# EAGLE design PCB_v1 (EAGLE 8.6.2)
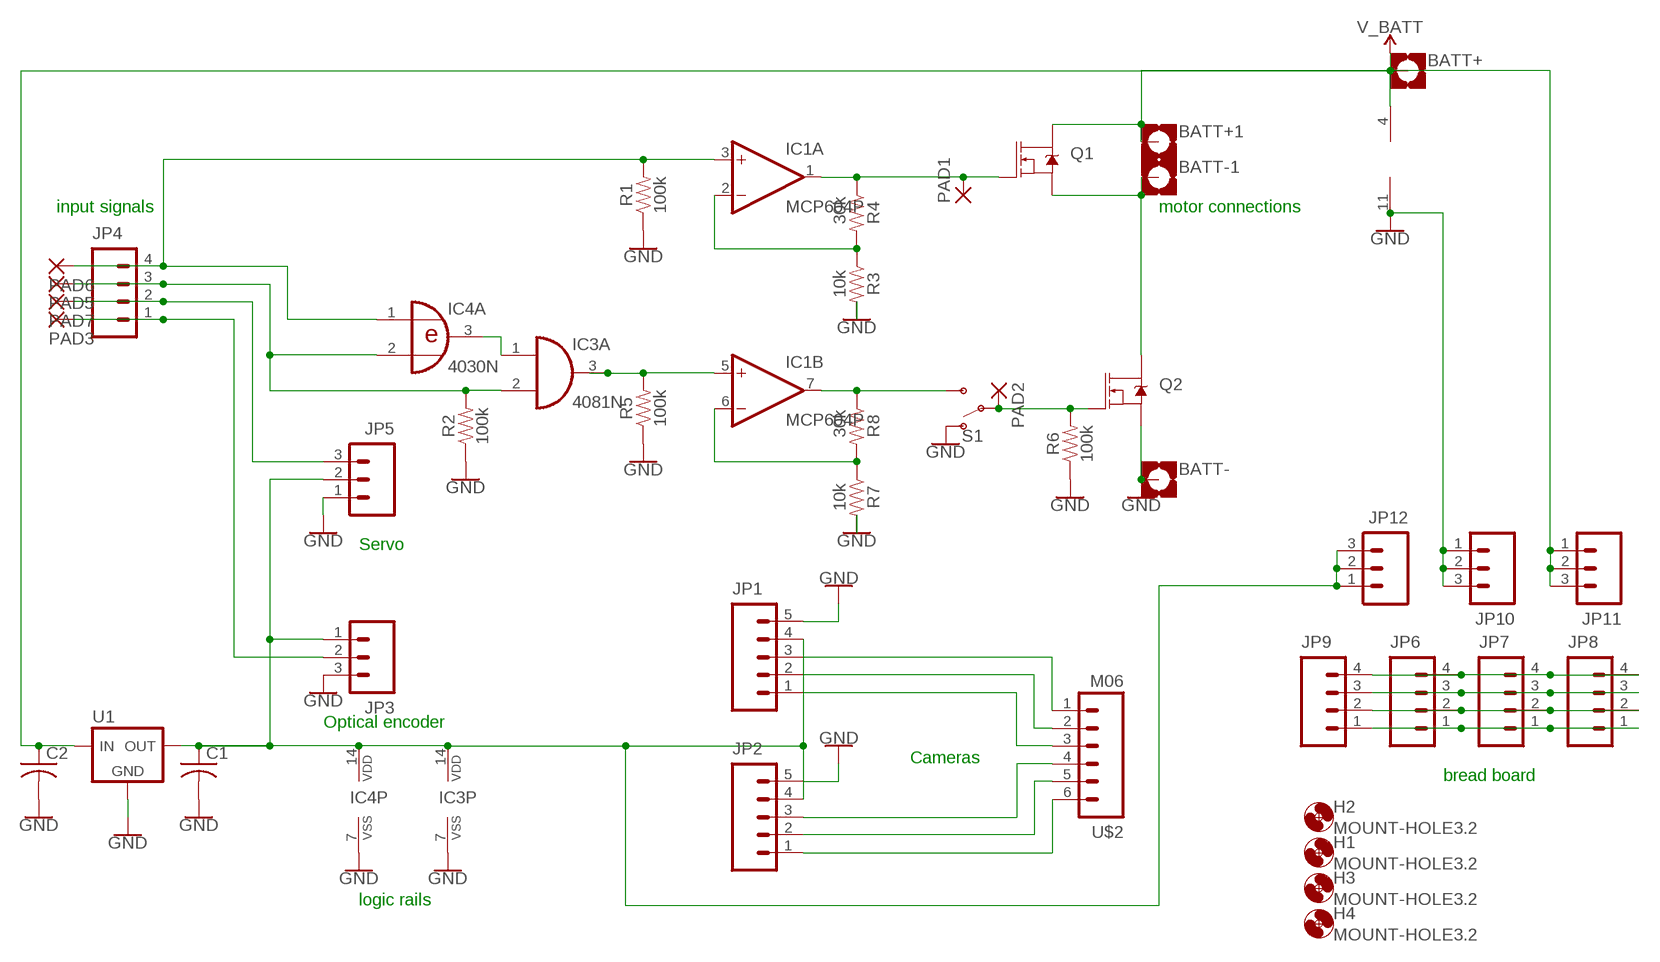
[diagram p0: schematic, sheet 1]

## Parts
BATT+  MOUNT-PAD-SQUARE3.0  [3,0-PAD-SQUARE]
BATT+1  MOUNT-PAD-SQUARE3.0  [3,0-PAD-SQUARE]
BATT-  MOUNT-PAD-SQUARE3.0  [3,0-PAD-SQUARE]
BATT-1  MOUNT-PAD-SQUARE3.0  [3,0-PAD-SQUARE]
C1  C-075PTH  [C075]
C2  C-075PTH  [C075]
H1  MOUNT-HOLE3.2  [3,2]
H2  MOUNT-HOLE3.2  [3,2]
H3  MOUNT-HOLE3.2  [3,2]
H4  MOUNT-HOLE3.2  [3,2]
IC1  MCP604P  [DIL14]
IC3  4081N  [DIL14]
IC4  4030N  [DIL14]
JP1  M05PTH  [1X05]
JP2  M05PTH  [1X05]
JP3  M03PTH  [1X03]
JP4  M04PTH  [1X04]
JP5  M03PTH  [1X03]
JP6  M04PTH  [1X04]
JP7  M04PTH  [1X04]
JP8  M04PTH  [1X04]
JP9  M04PTH  [1X04]
JP10  M03PTH  [1X03]
JP11  M03PTH  [1X03]
JP12  M03PTH  [1X03]
PAD1  2,15/1,0  [2,15/1,0]
PAD2  2,15/1,0  [2,15/1,0]
PAD3  2,15/1,0  [2,15/1,0]
PAD5  2,15/1,0  [2,15/1,0]
PAD6  2,15/1,0  [2,15/1,0]
PAD7  2,15/1,0  [2,15/1,0]
Q1  MOSFET-NCH-FQP30N06L  [TO220V]
Q2  MOSFET-NCH-FQP30N06L  [TO220V]
R1  100k  10KOHM-HORIZ-1/4W-1%  [AXIAL-0.3]
R2  100k  10KOHM-HORIZ-1/4W-1%  [AXIAL-0.3]
R3  10k  10KOHM-HORIZ-1/4W-1%  [AXIAL-0.3]
R4  30k  RESISTORAXIAL-0.3  [AXIAL-0.3]
R5  100k  10KOHM-HORIZ-1/4W-1%  [AXIAL-0.3]
R6  100k  10KOHM-HORIZ-1/4W-1%  [AXIAL-0.3]
R7  10k  10KOHM-HORIZ-1/4W-1%  [AXIAL-0.3]
R8  30k  RESISTORAXIAL-0.3  [AXIAL-0.3]
S1  SWITCH-SPDT-PTH-11.6X4.0MM-KIT  [SWITCH_SPDT_PTH_11.6X4.0MM_KIT]
U1  78XX-TO220V  [TO220BV]
U$2  M06  [1X06-MTA]

## Nets
GND: BATT-.B3,0(MOUNT) C1.2(-) C2.2(-) IC1.11(P:V-) IC3.7(P:VSS) IC4.7(P:VSS) JP1.5 JP2.5 JP3.3 JP5.1 JP10.1 JP10.2 JP10.3 Q2.3(S) R1.P$1 R2.P$1 R3.P$2 R5.P$1 R6.P$1 R7.P$2 S1.1(O) U1.2(GND)
N$1: IC1.2(A:-IN) R3.P$1 R4.P$2
N$2: IC1.1(A:OUT) PAD1.1(P) Q1.1(G) R4.P$1
N$3: IC1.6(B:-IN) R7.P$1 R8.P$2
N$5: PAD2.1(P) Q2.1(G) R6.P$2 S1.2(P)
N$6: BATT-1.B3,0(MOUNT) Q1.3(S) Q2.2(D)
N$7: IC1.7(B:OUT) R8.P$1 S1.3(S)
N$8: IC3.1(A:I0) IC4.3(A:O)
N$9: JP2.1 U$2.6
N$10: JP2.2 U$2.5
N$11: JP2.3 U$2.4
N$12: JP1.1 U$2.3
N$13: JP1.2 U$2.2
N$14: JP1.3 U$2.1
N$15: JP4.2 JP5.3 PAD7.1(P)
N$16: IC1.3(A:+IN) IC4.1(A:I0) JP4.4 PAD6.1(P) R1.P$2
N$17: IC3.2(A:I1) IC4.2(A:I1) JP4.3 PAD5.1(P) R2.P$2
N$18: C1.1(+) IC3.14(P:VDD) IC4.14(P:VDD) JP1.4 JP2.4 JP3.1 JP5.2 JP12.1 JP12.2 JP12.3 U1.3(VOUT)
N$19: JP3.2 JP4.1 PAD3.1(P)
N$20: IC1.5(B:+IN) IC3.3(A:O) R5.P$2
N$22: JP6.4 JP7.4 JP8.4 JP9.4
N$23: JP6.3 JP7.3 JP8.3 JP9.3
N$24: JP6.2 JP7.2 JP8.2 JP9.2
N$25: JP6.1 JP7.1 JP8.1 JP9.1
V_BATT: BATT+1.B3,0(MOUNT) BATT+.B3,0(MOUNT) C2.1(+) IC1.4(P:V+) JP11.1 JP11.2 JP11.3 Q1.2(D) U1.1(VIN)
Unconnected: IC1.8(C:OUT) IC1.9(C:-IN) IC1.10(C:+IN) IC1.12(D:+IN) IC1.13(D:-IN) IC1.14(D:OUT) IC3.4(B:O) IC3.5(B:I0) IC3.6(B:I1) IC3.8(C:I0) IC3.9(C:I1) IC3.10(C:O) IC3.11(D:O) IC3.12(D:I0) IC3.13(D:I1) IC4.4(B:O) IC4.5(B:I0) IC4.6(B:I1) IC4.8(C:I0) IC4.9(C:I1) IC4.10(C:O) IC4.11(D:O) IC4.12(D:I0) IC4.13(D:I1)

## Notes on the sheet
- input signals | motor connections
- Servo
- Optical encoder
- Cameras
- bread board
- logic rails

## Library data of the parts
BATT+ BATT+1 BATT- BATT-1 = holes:MOUNT-PAD-SQUARE: MOUNTING PAD, square
C1 C2 = bt_rcl:C: Capacitor, non-polarized, American symbol
H1-H4 = holes:MOUNT-HOLE: MOUNTING HOLE with drill center marker
IC1 = linear:MCP604: Quad Op Amp 2.7V to 6.0V Single Supply CMOS Source: http://ww1.microchip.com/downloads/en/DeviceDoc/21314g.pdf
IC3 = 40xx:4081: Quad 2-input AND
IC4 = 40xx:4030: Quad XOR
JP1 JP2 = ee192:M05: 5-pin 0.1-inch header and MTA connector Courtsey of Pioneers in Engineering; PIE-INT-REF-NUM: BULK-STOCK
JP3 JP5 JP10-JP12 = ee192:M03: 3-pin 0.1-inch header and MTA connector Courtsey of Pioneers in Engineering; PIE-INT-REF-NUM: BULK-STOCK
JP4 JP6-JP9 = ee192:M04: 4-pin 0.1-inch header and MTA connector Courtsey of Pioneers in Engineering; PIE-INT-REF-NUM: BULK-STOCK
PAD1-PAD3 PAD5-PAD7 = wirepad:2,15/1,0: THROUGH-HOLE PAD
Q1 Q2 = SparkFun-DiscreteSemi:MOSFET-NCH: N-channel MOSFETs Voltage controlled devices that allow control of high current outputs. SparkFun Products: SparkFun OpenScale <https://www.sparkfun.com/products/13261> SparkFun Digital Sandbox <https://www.sparkfun.com/products/12651> SparkFun Monster Moto Shield <https://www.sparkfun.com/products/10182> SparkFun MOSFET Power Controller <https://www.sparkfun.com/products/11214>; PROD_ID: TRANS-10060; VALUE: 60V/32A/35mΩ
R1 R2 R5 R6 = SparkFun-Resistors:10KOHM: 10kΩ resistor A resistor is a passive two-terminal electrical component that implements electrical resistance as a circuit element. Resistors act to reduce current flow, and, at the same time, act to lower voltage levels within circuits. - Wikipedia; PROD_ID: RES-12183; VALUE: 10k
R3 R7 = SparkFun-Resistors:10KOHM: 10kΩ resistor A resistor is a passive two-terminal electrical component that implements electrical resistance as a circuit element. Resistors act to reduce current flow, and, at the same time, act to lower voltage levels within circuits. - Wikipedia; PROD_ID: RES-12183
R4 R8 = SparkFun-Resistors:RESISTOR: Generic Resistor Package
S1 = SparkFun-Switches:SWITCH-SPDT: Single Pole, Double Throw (SPDT) Switch Single-pole, double-throw (SPDT) switch. Variant Overview SMD-AYZ0202 Surface Mount DPDT Switch <https://www.sparkfun.com/products/597> (COM-00597) Used on e.g. LilyPad Arduino USB - ATmega32U4 Board <https://www.sparkfun.com/products/12049> PTH-11.6X4.0MM SPDT Mini Power Switch <https://www.sparkfun.com/products/102> (COM-00102) Used on e.g. SparkFun Simon Says - Through-Hole Soldering Kit <https://www.sparkfun.com/products/10547> (KIT-10547) PTH-11.6X4.0MM-KIT KIT version of SPDT Mini Power Switch - Simplifies soldering by removing tStop of switch pins - only one side can be soldered. PTH-11.6X4.0MM-LOCK LOCK version of SPDT Mini Power Switch - Offset pins hold switch in place for easier soldering. SMD-RIGHT-ANGLE Surface Mount Right Angle Switch <https://www.sparkfun.com/products/10860> (COM-10860) Used on e.g. SparkFun ESP8266 Thing <https://www.sparkfun.com/products/13231>; PROD_ID: SWCH-08261; SF_SKU: COM-00102
U1 = bt_regulator:78XX: 78XX Linear Voltage Regulator The venerable 7800-series Linear Voltage Regulator, including 7805, 7809, 7812, 7815, 7862 in 5 V, 6.2 V, 8.2 V, 9 V, 12 V, and 15 V, respectively Datasheets TI_LM78L05.pdf <http://www.ti.com/lit/ds/symlink/lm78l05.pdf> Fairchild_LM7805.pdf <https://www.fairchildsemi.com/datasheets/LM/LM7805.pdf>
U$2 = ee192:M06: 6-pin 0.1-inch MTA connector Courtsey of Pioneers in Engineering; PIE-INT-REF-NUM: MTA

## Board
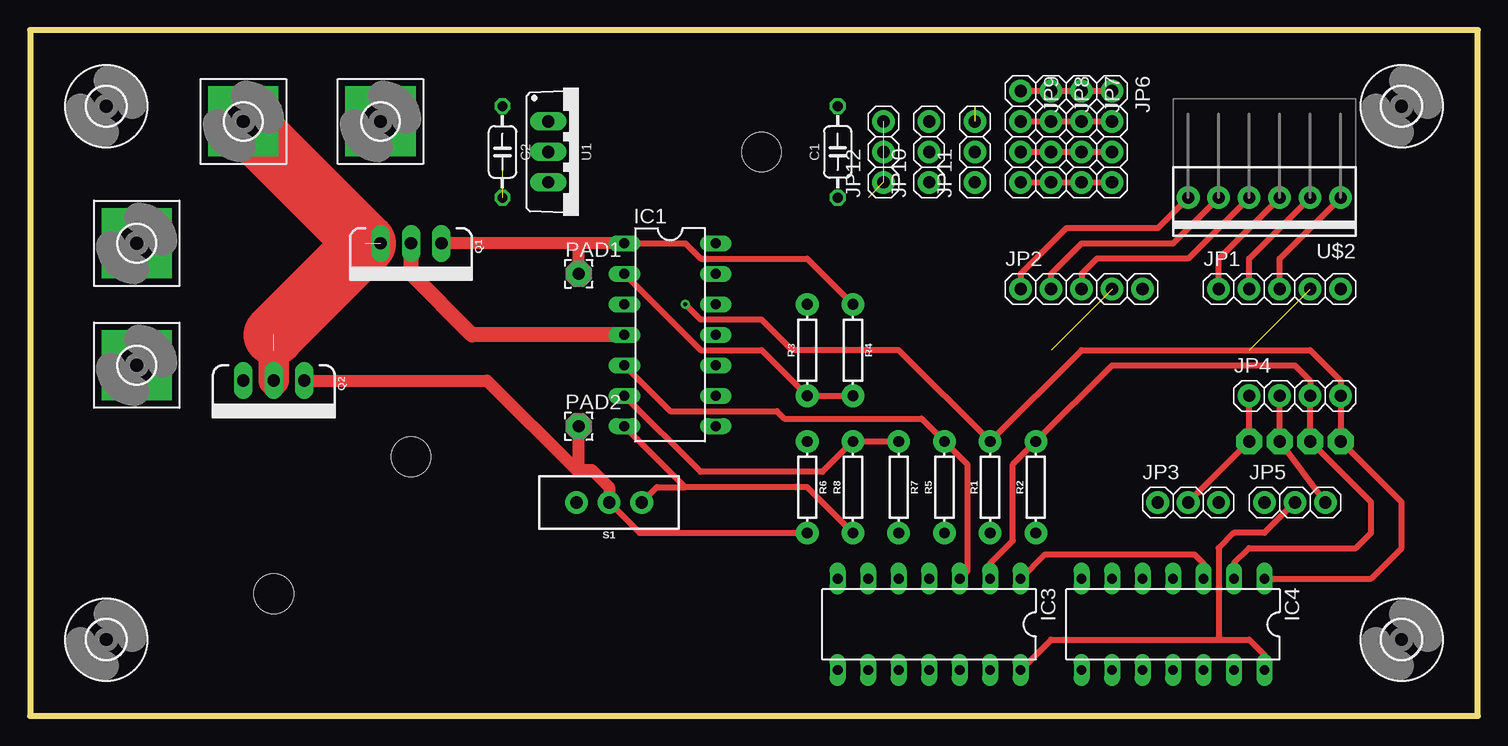
[diagram p1: board, top side]
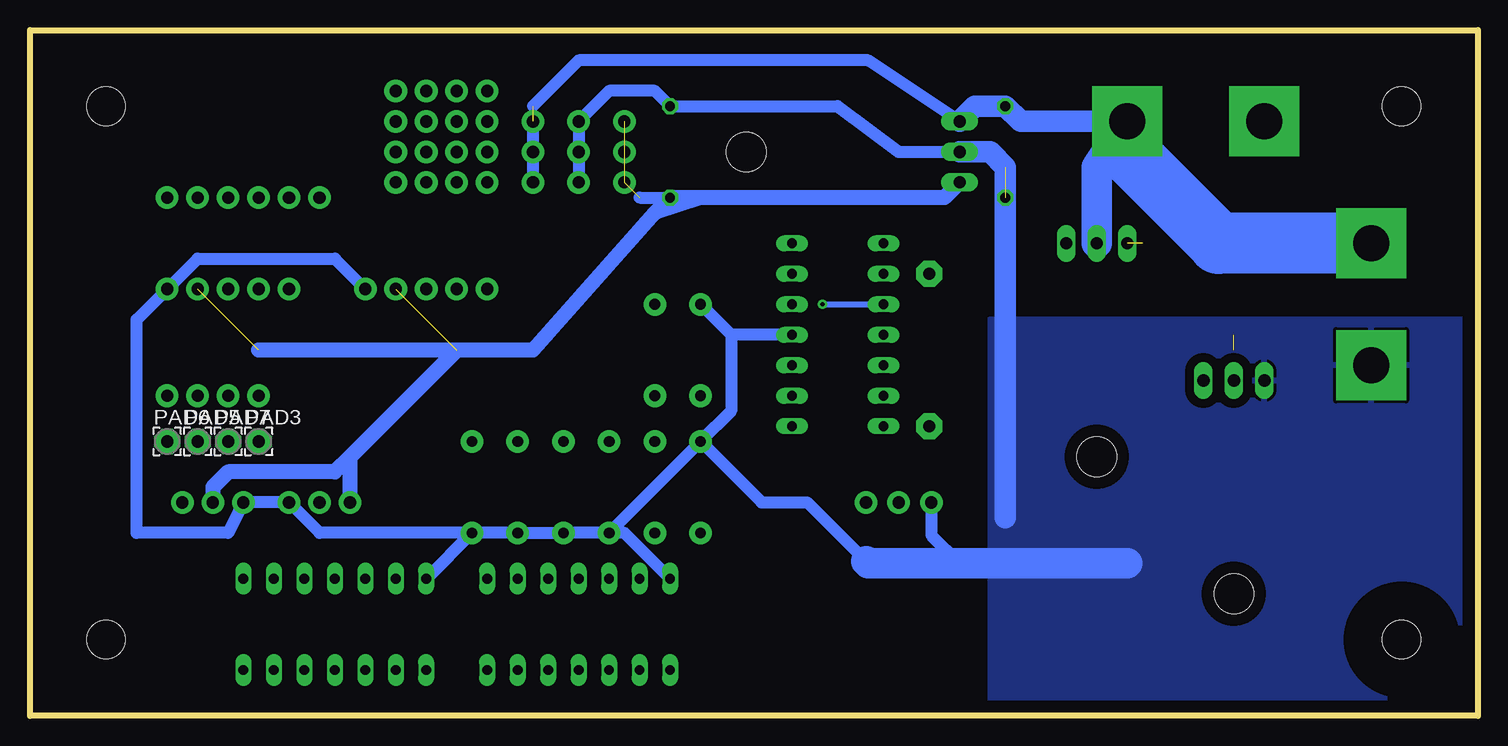
[diagram p2: board, bottom side, seen from below]

Size 120.65 x 57.15 mm. Coordinates in mm from the lower left corner, seen from the top.
Outline: 0,57.15 0,0 120.65,0 120.65,57.15 0,57.15
Copper layers (1*16): Top 0.035mm / dielectric 1.5mm / Bottom 0.035mm
Design rules "default": minimum track width 6mil, minimum drill 0.35mm, track to track 6mil, track to pad 6mil, pad to pad 6mil, via to via 6mil, smd to smd 6mil, copper to edge 40mil, drill to drill 6mil, minimum pad ring 10mil, minimum via ring 8mil, stop-mask expansion 4mil, vias tented up to drill 0mil, thermal gap 10mil
Holes 3.3 mm at 31.75,21.59 20.32,10.16 60.96,46.99

### Footprints (pad centres in the part's own frame; a part is rotated, then mirrored left to right if it is on the bottom)
3,0-PAD-SQUARE = drill 3 pad 5.842 square: B3,0 0,0
C075 = drill 0.813 octagon: 1 -3.81,0; 2 3.81,0
3,2 = hole 3.2: 0,0
DIL14 = drill 0.813 long: 1 -7.62,-3.81; 2 -5.08,-3.81; 3 -2.54,-3.81; 4 0,-3.81; 5 2.54,-3.81; 6 5.08,-3.81; 7 7.62,-3.81; 8 7.62,3.81; 9 5.08,3.81; 10 2.54,3.81; 11 0,3.81; 12 -2.54,3.81; 13 -5.08,3.81; 14 -7.62,3.81
1X05 = drill 1.016 pad 1.88: 1 -5.08,0; 2 -2.54,0; 3 0,0; 4 2.54,0; 5 5.08,0
1X03 = drill 1.016 pad 1.88: 1 -2.54,0; 2 0,0; 3 2.54,0
1X04 = drill 1.016 pad 1.88: 1 -3.81,0; 2 -1.27,0; 3 1.27,0; 4 3.81,0
2,15/1,0 = drill 1.016 pad 2.159 octagon: 1 0,0
TO220V = drill 1.016 long: 1 -2.54,0; 2 0,0; 3 2.54,0
AXIAL-0.3 = drill 0.9 pad 1.88: P$1 -3.81,0; P$2 3.81,0
SWITCH_SPDT_PTH_11.6X4.0MM_KIT = drill 1.016 pad 1.88: 1 0,2.718; 2 0,0; 3 0,-2.718
TO220BV = drill 1.016 long: 1 -2.54,0; 2 0,0; 3 2.54,0
1X06-MTA = drill 1.016 pad 1.88: 1 -6.35,0; 2 -3.81,0; 3 -1.27,0; 4 1.27,0; 5 3.81,0; 6 6.35,0

### Placement (x,y rotation side)
BATT+  8.89,39.37 0 top
BATT+1  29.21,49.53 0 top
BATT-  8.89,29.21 0 top
BATT-1  17.78,49.53 0 top
C1  67.31,46.99 90 top
C2  39.37,46.99 270 top
H1  114.3,6.35 0 top
H2  114.3,50.8 0 top
H3  6.35,50.8 0 top
H4  6.35,6.35 0 top
IC1  53.34,31.75 270 top
IC3  74.93,7.62 180 top
IC4  95.25,7.62 180 top
JP1  104.14,35.56 0 top
JP2  87.63,35.56 0 top
JP3  96.52,17.78 0 top
JP4  105.41,26.67 0 top
JP5  105.41,17.78 0 top
JP6  90.17,48.26 270 top
JP7  87.63,48.26 270 top
JP8  85.09,48.26 270 top
JP9  82.55,48.26 270 top
JP10  74.93,46.99 90 top
JP11  78.74,46.99 90 top
JP12  71.12,46.99 90 top
PAD1  45.72,36.83 0 top
PAD2  45.72,24.13 0 top
PAD3  101.6,22.86 0 bottom
PAD5  106.68,22.86 0 bottom
PAD6  109.22,22.86 0 bottom
PAD7  104.14,22.86 0 bottom
Q1  31.75,39.37 180 top
Q2  20.32,27.94 180 top
R1  80.01,19.05 90 top
R2  83.82,19.05 90 top
R3  64.77,30.48 90 top
R4  68.58,30.48 270 top
R5  76.2,19.05 90 top
R6  64.77,19.05 270 top
R7  72.39,19.05 270 top
R8  68.58,19.05 90 top
S1  48.26,17.78 90 top
U1  43.18,46.99 270 top
U$2  102.87,43.18 180 top

### Tracks (layer width: path | path; a pad name or v marks a point on that pad's centre or on a via)
GND  (1 unrouted)
  Bottom 1.016: R7.P$2 R5.P$1 R1.P$1 R2.P$1 | R6.P$1 R7.P$2 | R3.P$2 62.23,31.75 | 62.23,31.75 62.23,25.4 R6.P$1 | R6.P$1 59.69,17.78 55.88,17.78 50.98,12.88 | IC1.11 62.23,31.75 | U1.2 48.26,46.99 53.34,50.8 C1.2 68.58,52.07 72.39,52.07 JP10.3 JP10.2 JP10.1 | R2.P$1 96.52,15.24 JP3.3 JP5.1 104.14,15.24 111.76,15.24 111.76,33.02 JP1.5 106.68,38.1 95.25,38.1 JP2.5 | S1.1 45.54,15.06 43.18,12.7 | R2.P$1 IC4.7 | IC3.7 71.12,15.24 R7.P$2
  Bottom 1.778: U1.2 40.64,46.99 39.37,45.72 39.37,16.51
  Bottom 2.54: 29.21,12.7 43.18,12.7 50.8,12.7 50.98,12.88
  pour Bottom (isolate 0.762): 1.27,33.02 40.64,33.02 40.64,1.27 1.27,1.27
N$1
  Top 0.508: R4.P$2 R3.P$1 60.96,30.48 55.88,30.48 IC1.2
N$2
  Top 0.508: IC1.1 54.61,39.37 55.88,38.1 64.77,38.1 R4.P$1
  Top 1.016: 45.72,39.37 Q1.1 | IC1.1 45.72,39.37 | PAD1.1 45.72,39.37
N$3
  Top 0.508: R7.P$1 R8.P$2 66.04,20.32 55.88,20.32 IC1.6
N$5
  Top 0.508: S1.2 50.8,15.24 R6.P$2
  Top 1.016: Q2.1 38.1,27.94 45.54,20.5 45.72,20.5 | 45.72,20.5 46.81,20.5 48.26,19.05 S1.2 | 45.72,20.5 PAD2.1
N$6  (2 unrouted)
  Top 2.54: Q2.2 20.32,30.48
  Top 5.08: BATT-1.B3,0 27.94,39.37 20.32,31.75
N$7
  Top 0.508: R8.P$1 64.77,19.05 54.61,19.05 | 54.61,19.05 IC1.7 | S1.3 52.25,19.05 54.61,19.05
N$8
  Top 0.508: IC3.1 84.58,13.46 97.03,13.46 97.79,12.7 IC4.3
N$9
  Top 0.508: JP2.1 82.55,36.83 86.36,40.64 93.98,40.64 U$2.6
N$10
  Top 0.508: JP2.2 85.09,36.83 87.63,39.37 95.25,39.37 U$2.5
N$11
  Top 0.508: U$2.4 96.52,38.1 88.9,38.1 87.63,36.83 JP2.3
N$12
  Top 0.508: U$2.3 99.06,38.1 JP1.1
N$13
  Top 0.508: JP1.2 101.6,38.1 U$2.2
N$14
  Top 0.508: JP1.3 104.14,38.1 U$2.1
N$15
  Top 0.508: JP5.3 PAD7.1 JP4.2
N$16  (via drill 0.35)
  Top 0.508: v54.61,34.29 55.88,33.02 60.96,33.02 63.5,30.48 72.39,30.48 R1.P$2 87.63,30.48 106.68,30.48 109.22,27.94 JP4.4 PAD6.1 114.3,17.78 114.3,13.97 111.76,11.43 IC4.1
  Bottom 0.508: v54.61,34.29 IC1.3
N$17
  Top 0.508: IC3.2 80.01,12.7 81.91,14.61 81.91,20.95 R2.P$2 90.17,29.21 105.41,29.21 106.68,27.94 JP4.3 PAD5.1 111.76,17.78 111.76,15.24 110.49,13.97 101.6,13.97 100.33,12.7 IC4.2
N$18  (5 unrouted)
  Top 0.508: IC3.14 85.09,6.35 99.06,6.35 | 99.06,6.35 101.6,6.35 102.87,5.08 IC4.14 | JP5.2 102.87,15.24 100.33,15.24 99.06,13.97 99.06,6.35
  Bottom 1.016: 69.85,43.18 C1.1
  Bottom 1.27: 85.09,30.48 78.74,30.48 68.58,41.91 | 85.09,30.48 101.6,30.48 | 93.98,21.59 85.09,30.48 | JP3.1 93.98,21.59 | U1.3 44.45,43.18 64.77,43.18 | 64.77,43.18 C1.1 68.58,41.91 | 64.77,43.18 68.58,41.91 | 93.98,21.59 95.25,20.32 104.14,20.32 105.41,19.05 JP5.2
N$19
  Top 0.508: JP3.2 PAD3.1 JP4.1
N$20
  Top 0.508: IC1.5 53.34,25.4 62.23,25.4 62.87,24.76 74.3,24.76 R5.P$2 78.11,20.95 78.11,12.07 IC3.3
N$22
  Top 0.508: JP9.4 JP8.4 JP7.4 JP6.4
N$23
  Top 0.508: JP9.3 JP8.3 JP7.3 JP6.3
N$24
  Top 0.508: JP9.2 JP8.2 JP7.2 JP6.2
N$25
  Top 0.508: JP9.1 JP8.1 JP7.1 JP6.1
V_BATT  (1 unrouted)
  Top 1.27: IC1.4 36.83,31.75 31.75,36.83 Q1.2
  Bottom 1.016: U1.1 50.8,54.61 74.93,54.61 78.74,50.8 | JP11.3 JP11.2 JP11.1
  Bottom 1.778: BATT+1.B3,0 38.1,49.53 C2.1 41.91,50.8 U1.1
  Bottom 2.54: BATT+1.B3,0 31.75,45.72 Q1.2
  Bottom 5.08: 29.21,48.26 BATT+1.B3,0 29.21,46.99 21.59,39.37 BATT+.B3,0